# Altium schematic sheet ON_OFF_Controller.SchDoc
size A3; SheetNumber: 9; SheetTotal: 9
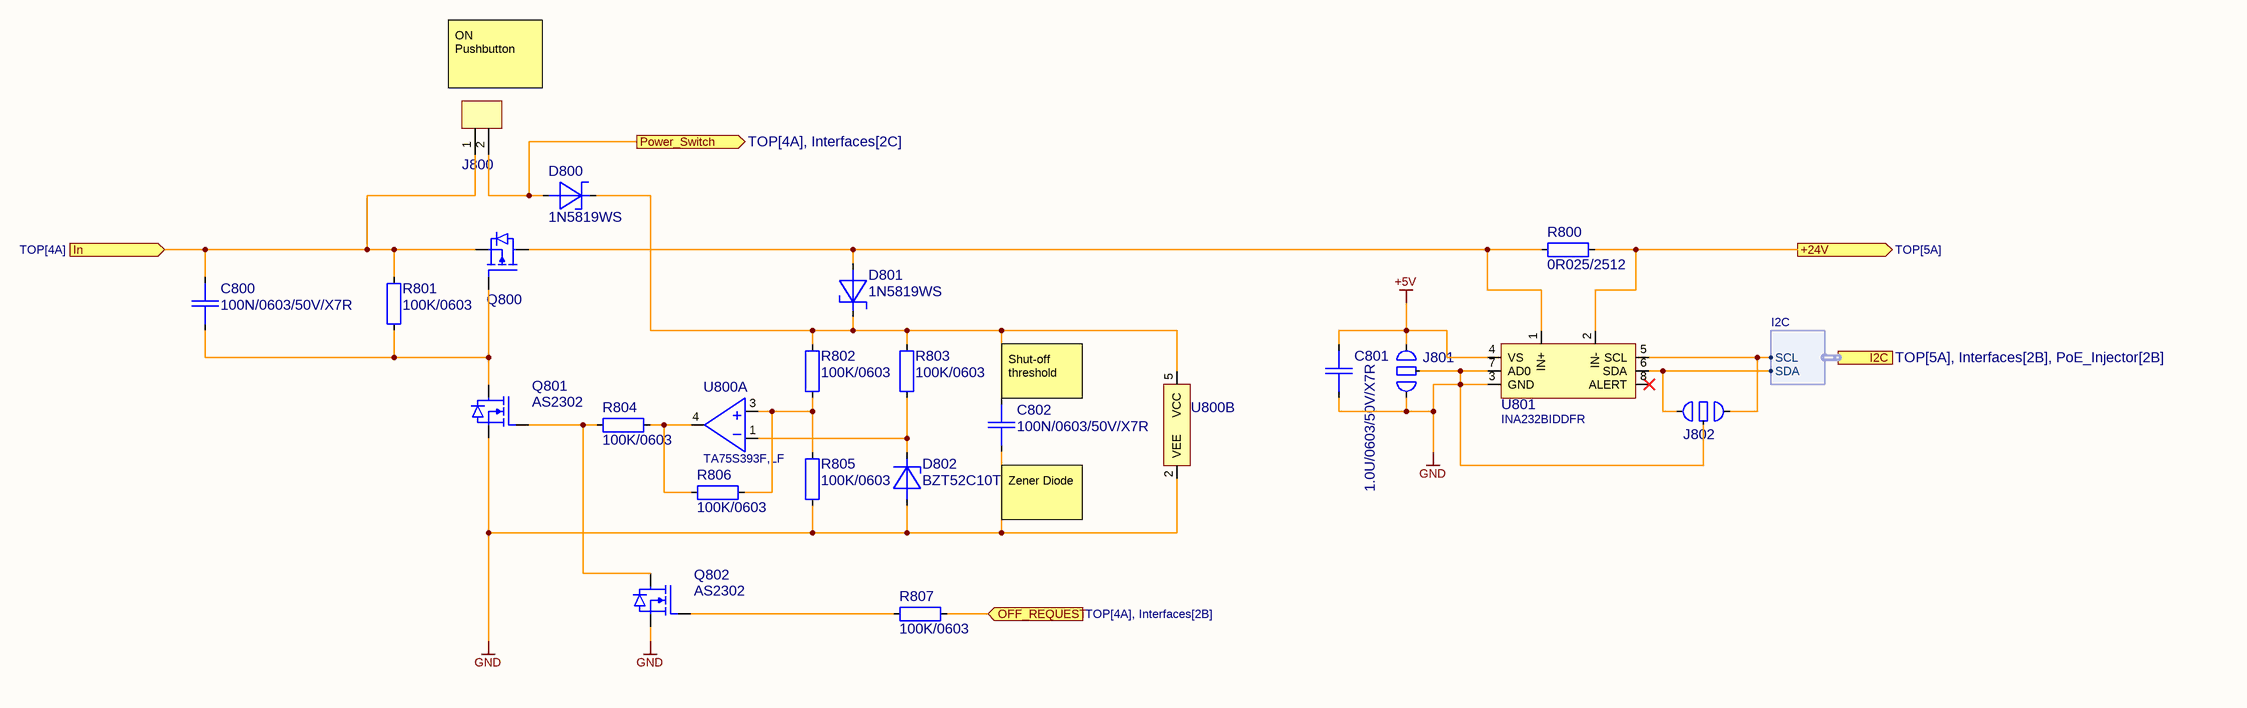
[diagram p0: ON_OFF_Controller.SchDoc]

## Parts
C800  100N/0603/50V/X7R  [CAP0603_X7R]
C801  1.0U/0603/50V/X7R  [CAP0603_X7R]
C802  100N/0603/50V/X7R  [CAP0603_X7R]
D800  1N5819WS  [SOD2513X100]
D801  1N5819WS  [SOD2513X100]
D802  BZT52C10T  [SOD1608X065]
J800  430450212  [430450212]  (value not drawn)
J801  Solder Jumper 3pin 0.2mm  [Solder_Jumper_3pin_0.2mm]  (value not drawn)
J802  Solder Jumper 3pin 0.2mm  [Solder_Jumper_3pin_0.2mm]  (value not drawn)
Q800  MCG35P04-TP  [SON065P330X330X075-5-TH245X175]  (value not drawn)
Q801  AS2302  [SOT2395P280X125-3-SE]
Q802  AS2302  [SOT2395P280X125-3-SE]
R800  0R025/2512  [R2512-0.65-WW]
R801  100K/0603  [R0603-0.40-WW]
R802  100K/0603  [R0603-0.40-WW]
R803  100K/0603  [R0603-0.40-WW]
R804  100K/0603  [R0603-0.40-WW]
R805  100K/0603  [R0603-0.40-WW]
R806  100K/0603  [R0603-0.40-WW]
R807  100K/0603  [R0603-0.40-WW]
U800  TA75S393F,LF  [SOT2395P280X125-5-SW]  (parts A,B of 2)
U801  INA232BIDDFR  [SOT065P280X110-8-SE]

## Ports
+24V (out, see TOP[5A]), I2C (harness I2C, see TOP[5A], Interfaces[2B], PoE_Injector[2B]), In (in, see TOP[4A]), OFF_REQUEST (in, see TOP[4A], Interfaces[2B]), Power_Switch (out, see TOP[4A], Interfaces[2C])

## Harnesses
I2C: SDA, SCL

## Nets
+5V: C801.1 J801.3 U801.4(VS)
GND: C801.2 C802.2 D802.2 J801.1 J801.2 J802.2 Q801.2(SOURCE) Q802.2(SOURCE) R805.2 U800.2(VEE) U801.3(GND) U801.7(AD0)
+24V: R800.2 U801.2(IN-) ; port +24V
In: C800.1 J800.1 Q800.S(SOURCE) R801.1 ; port In
OFF_REQUEST: R807.1 ; port OFF_REQUEST
Power_Switch: D800.2 J800.2 ; port Power_Switch
NetC800_2: C800.2 Q800.G(GATE) Q801.3(DRAIN) R801.2
NetC802_1: C802.1 D800.1 D801.1 R802.1 R803.1 U800.5(VCC)
NetD801_2: D801.2 Q800.D(DRAIN) R800.1 U801.1(IN+)
NetD802_1: D802.1 R803.2 U800.1(IN-)
NetJ802_1: J802.1 U801.6(SDA) ; port I2C.SDA
NetJ802_3: J802.3 U801.5(SCL) ; port I2C.SCL
NetQ801_1: Q801.1(GATE) Q802.3(DRAIN) R804.1
NetQ802_1: Q802.1(GATE) R807.2
NetR802_2: R802.2 R805.1 R806.1 U800.3(IN+)
NetR804_2: R804.2 R806.2 U800.4(OUT)

Not connected (* = marked no-connect by the designer): U801 8(ALERT)*

## Notes on the sheet
- (near J800) ON Pushbutton
- (near C802) Shut-off threshold
- (near C802) Zener Diode
- Date:
- Size:
- A3
- Schema:
- Layout:

## Library data of the parts
C800 C802 = 100N/0603/50V/X7R: CAP SM 0603 100nF 50V X7R; Manufacturer: GENERIC; Manufacturer 1: YAGEO; Manufacturer Part Number 1: CC0603KPX7R9BB104; Absolute Value: 1E-7; Eurocircuits GPN: GPC0603104; Part Number: 100N/0603/50V/X7R; Package: 0603; Value: 100nF; HelpURL: https://www.yageo.com/upload/media/product/app/datasheet/mlcc/upy-gphc_x7r_6_3v-to-250v.pdf; Supplier 1: Digi-Key; Supplier Part Number 1: 311-3567-1-ND; Manufacturer 2: YAGEO; Manufacturer Part Number 2: CC0603MRX7R9BB104; Supplier 2: Digi-Key; Supplier Part Number 2: 311-4110-1-ND; Supplier 3: LCSC; Supplier Part Number 3: C14663; JLC Type: Basic
C801 = 1.0U/0603/50V/X7R: CAP SM 0603 1.0uF 50V X7R; Manufacturer: GENERIC; Manufacturer 1: YAGEO; Manufacturer Part Number 1: CC0603KRX7R9BB105; Absolute Value: 1E-6; Eurocircuits GPN: GPC0603105; Part Number: 1.0U/0603/50V/X7R; Package: 0603; Value: 1.0uF; HelpURL: https://www.yageo.com/upload/media/product/app/datasheet/mlcc/upy-gphc_x7r_6_3v-to-250v.pdf; Supplier 1: Digi-Key; Supplier Part Number 1: 311-2082-1-ND
D800 D801 = 1N5819WS: 40V 600mV@1A 1A SOD-323 Schottky Barrier Diodes (SBD) ROHS; Manufacturer: GENERIC; Part Number: 1N5819WS; Package: SOD323; Value: 1N5819WS; Absolute Value: 40V; HelpURL: https://datasheet.lcsc.com/lcsc/2204281430_Guangdong-Hottech-1N5819WS_C191023.pdf; Manufacturer 3: Guangdong Hottech; Manufacturer Part Number 3: 1N5819WS; Supplier 3: LCSC; Supplier Part Number 3: C191023; JLC Type: Basic
D802 = BZT52C10T: DIODE ZENER 10V 100MW SOD523; Manufacturer: Micro Commercial Co; Manufacturer Part Number 1: BZT52C10T-TP; Part Number: BZT52C10T; Package: SC-79, SOD-523; Value: BZT52C10T; Absolute Value: 10 V; HelpURL: https://www.mccsemi.com/pdf/Products/BZT52C(B)2V4T-BZT52C(B)39T(SOD-523).pdf; Manufacturer 1: Micro Commercial Co; Supplier 1: Digi-Key; Supplier Part Number 1: 353-BZT52C10T-TPCT-ND; Manufacturer 2: Diodes Incorporated; Manufacturer Part Number 2: BZT52C10T-7; Supplier 2: Digi-Key; Supplier Part Number 2: BZT52C10T-7DICT-ND
J800 = Microfit_3.0_1x2_VERT_THT: Micro-Fit 3.0 Vertical Header, 3.00mm Pitch, Dual Row, 2 Circuits, with PCB Polarizing Peg, Tin, Glow-Wire Capable, Black; Manufacturer 1: Molex; Part Number: Microfit_3.0_1x2_VERT_THT; HelpURL: https://tools.molex.com/pdm_docs/ps/PS-43045.pdf; Manufacturer Part Number 1: 430450212; Supplier 1: Digi-Key; Supplier Part Number 1: WM1789-ND
J801 J802 = Solder_Jumper_3pin_0.2mm: Solder jumper with three pins with a spacing of 0.2mm; Manufacturer: NONE; Part Number: Solder_Jumper_3pin_0.2mm
Q800 = MCG35P04-TP: 40V 35A P-Channel MOSFET; Manufacturer: Micro Commercial Co; Manufacturer Part Number 1: 353-MCG35P04-TPCT-ND; Part Number: MCG35P04-TP; HelpURL: https://www.mccsemi.com/pdf/Products/MCG35P04(DFN3333).pdf; Manufacturer 1: Micro Commercial Co; Supplier 1: Digi-Key; Supplier Part Number 1: 353-MCG35P04-TPCT-ND
Q801 Q802 = AS2302: N-Channel 20V(D-S) MOSFET; Manufacturer: GENERIC; Manufacturer 1: ANBON SEMICONDUCTOR (INT'L) LIMITED; Part Number: AS2302; Package: SOT23; HelpURL: https://datasheet.lcsc.com/lcsc/1809211431_AnBon-AS2302_C232266.pdf; Manufacturer Part Number 1: AS2302; Supplier 1: Digi-Key; Supplier Part Number 1: 4530-AS2302CT-ND; Manufacturer 3: AnBon; Manufacturer Part Number 3: AS2302; Supplier 3: LCSC; Supplier Part Number 3: C232266; JLC Type: Extended
R800 = 0R025/2512: RES SM 2512 0R025; Manufacturer: GENERIC; Manufacturer 1: Ohmite; Manufacturer Part Number 1: MCS3264R025FER; Absolute Value: 0.025; Part Number: 0R025/2512; Package: 2512; Value: 0R025; HelpURL: https://www.ohmite.com/assets/docs/res_mcs.pdf?r=false; Supplier 1: Digi-Key; Supplier Part Number 1: MCS3264R025FERCT-ND
R801-R807 = 100K/0603: RES SM 0603 100K; Manufacturer: GENERIC; Manufacturer 1: YAGEO; Manufacturer Part Number 1: RC0603FR-13100KL; Absolute Value: 100000; Eurocircuits GPN: GPR0603100K; Part Number: 100K/0603; Package: 0603; Value: 100K; HelpURL: https://www.yageo.com/upload/media/product/productsearch/datasheet/rchip/PYu-RC_Group_51_RoHS_L_12.pdf; Supplier 1: Digi-Key; Supplier Part Number 1: 13-RC0603FR-13100KLCT-ND; Manufacturer 2: YAGEO; Manufacturer Part Number 2: RC0603FR-10100KL; Supplier 2: Digi-Key; Supplier Part Number 2: 13-RC0603FR-10100KLCT-ND; Manufacturer 3: UNI-ROYAL(Uniroyal Elec); Manufacturer Part Number 3: 0603WAF1003T5E; Supplier 3: LCSC; Supplier Part Number 3: C25803; JLC Type: Basic
U800 = TA75S393F,LF: 36V Single Voltage Comparator; Manufacturer: Toshiba Semiconductor and Storage; Part Number: TA75S393F,LF; Package: SOT23-5; HelpURL: https://toshiba.semicon-storage.com/info/TA75S393F_datasheet_en_20220525.pdf?did=20981&prodName=TA75S393F; Manufacturer 1: Toshiba Semiconductor and Storage; Manufacturer Part Number 1: TA75S393F,LF; Supplier 1: Digi-Key; Supplier Part Number 1: TA75S393FLFCT-ND; Manufacturer 3: TOSHIBA; Manufacturer Part Number 3: TA75S393F,LF(T; Supplier 3: LCSC; Supplier Part Number 3: C840438
U801 = INA232BIDDFR: INA232 48-V, 16-Bit, Current, Voltage, and Power Monitor With an I2C Interface; Manufacturer: Texas Instruments; Part Number: INA232BIDDFR; Package: SOT23-8; HelpURL: https://www.ti.com/lit/ds/symlink/ina232.pdf; Manufacturer 1: Texas Instruments; Manufacturer Part Number 1: INA232BIDDFR; Supplier 1: Digi-Key; Supplier Part Number 1: 296-INA232BIDDFRCT-ND